# EasyEDA schematic SCH_LUMOS Reflective Device PCB_2023-02-24.json
TITLE: LUMOS Reflective device; REV: 1.0; Date: 2022-08-15; Sheet: 1/1
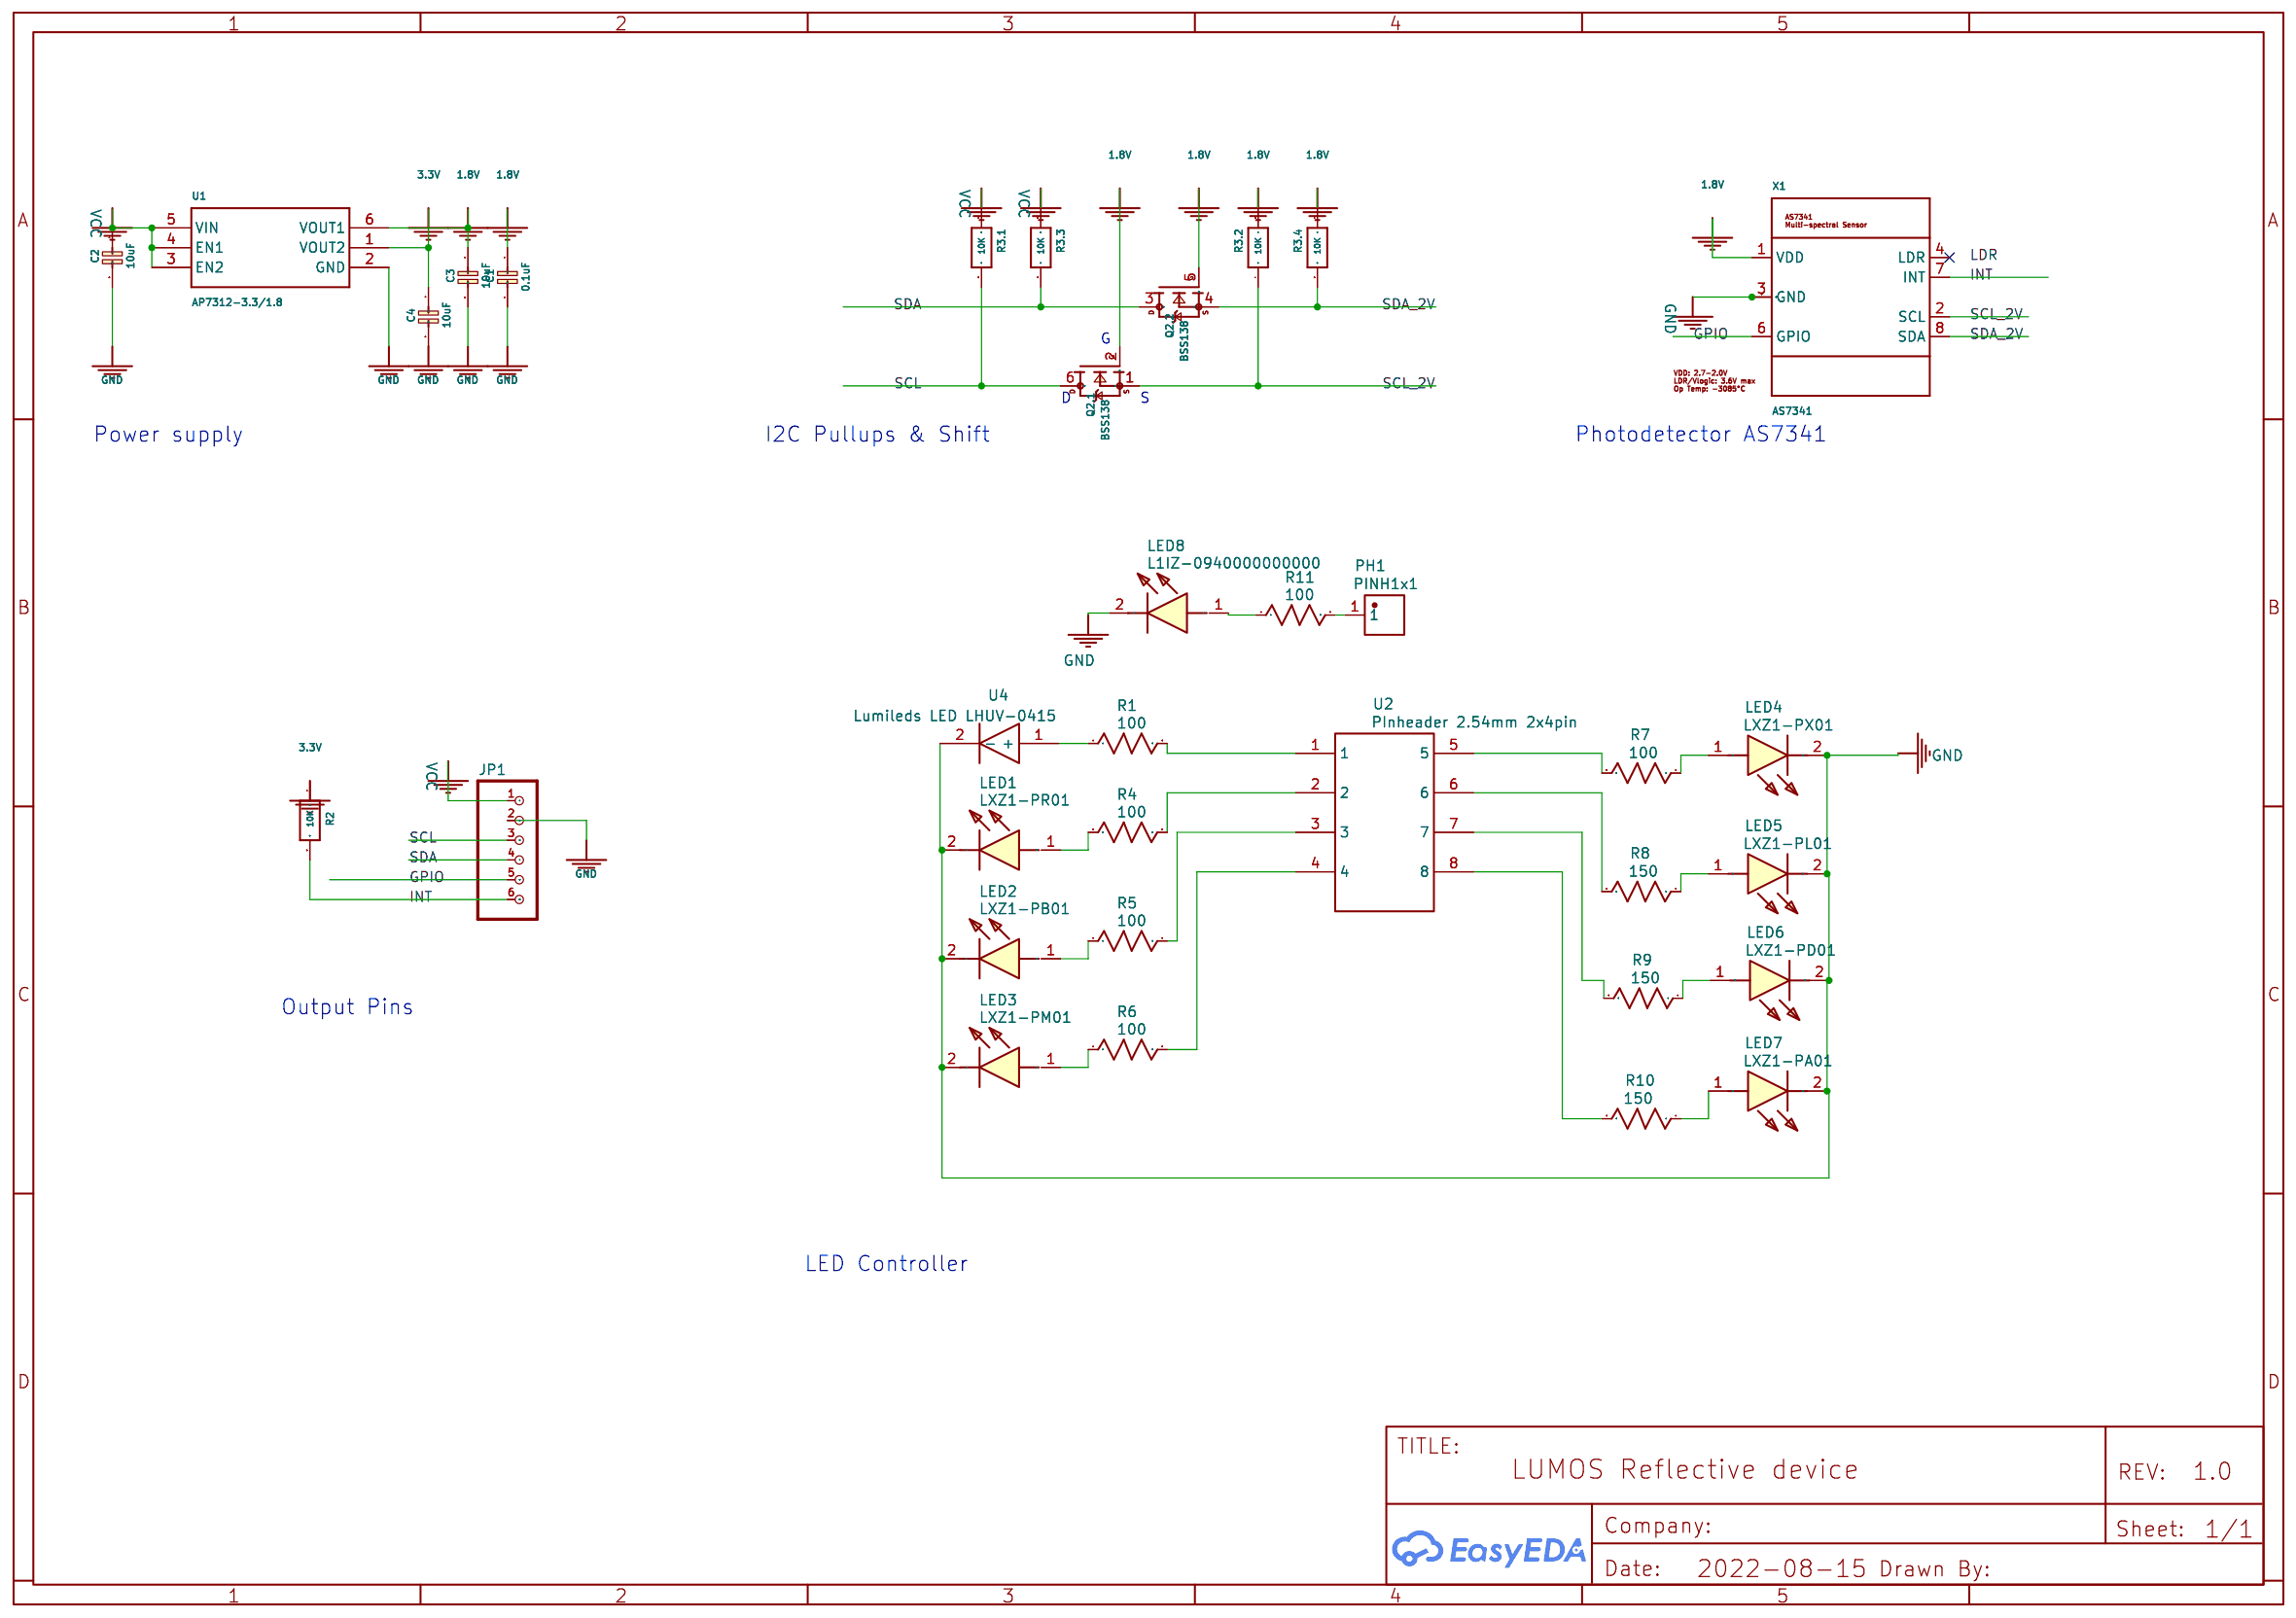
[diagram p0: schematic sheet]

## Parts
C1  0.1uF  [0603-NO]
C2  10uF  [0805-NO]
C3  10uF  [0805-NO]
C4  10uF  [0805-NO]
JP1  HEADER-1X670MIL  [1X06]
LED1  LXZ1-PR01  [LXZ1PR01]
LED2  LXZ1-PB01  [LXZ1PR01]
LED3  LXZ1-PM01  [LXZ1PR01]
LED4  LXZ1-PX01  [LXZ1PR01]
LED5  LXZ1-PL01  [LXZ1PR01]
LED6  LXZ1-PD01  [LXZ1PR01]
LED7  LXZ1-PA01  [LXZ1PR01]
LED8  L1IZ-0940000000000  [LXZ1PR01]
PH1  PINH1x1  [PINHEADER_1X1]
Q2  BSS138  [PG-SOT363-6_L2.0-W1.3-P0.65-LS2.1-BR]  (sections 1,2)
R1  100  [R0603]
R2  10K  [0603-NO]
R3  10K  [R_ARRAY_CONCAVE_4X0603]  (sections 1,2,3,4)
R4  100  [R0603]
R5  100  [R0603]
R6  100  [R0603]
R7  100  [R0603]
R8  150  [R0603]
R9  150  [R0603]
R10  150  [R0603]
R11  100  [R0603]
U1  AP7312-3.3/1.8  [PG-SOT23-6_L2.9-W1.6-P0.95-LS2.8-BR]
U2  PInheader 2.54mm 2x4pin  [PINHEADER 2X4PIN]
U4  Lumileds LED LHUV-0415  [LUMILEDS LED LHUV-0415]
U$1  MOUNTINGHOLE2.5  [MOUNTINGHOLE_2.5_PLATED]
U$17  MOUNTINGHOLE2.5  [MOUNTINGHOLE_2.5_PLATED]
U$19  MOUNTINGHOLE2.5  [MOUNTINGHOLE_2.5_PLATED]
U$21  MOUNTINGHOLE2.5  [MOUNTINGHOLE_2.5_PLATED]
X1  AS7341  [AS7341]

## Library data of the parts
LED1-LED8 = LXZ1-PR01: Contributor: onemanarmy
PH1 = PINH1x1: Contributor: LeynaertV
R1 R4-R11 = R_0603_US: Contributor: LCEDA_Lib
U2 = PInheader 2.54mm 2x4pin: Contributor: pat.nieder05
U4 = Lumileds LED LHUV-0415: Manufacturer: Lumileds; Supplier: Mouser; link: https://www.mouser.com/ProductDetail/Lumileds/LHUV-0415-A070?qs=Au78WOuo%252BOdNiuSbXqPegw%3D%3D; Contributor: Евгений Индюков

## Nets
1.8V: C1.1 C3.1 Q2.2(G) Q2.5(G) R3.2(1) R3.4(1) U1.6(VOUT1) X1.1(VDD)
3.3V: C4.1 R2.1 U1.1(VOUT2)
GND: C1.2 C2.2 C3.2 C4.2 JP1.2 LED1.2(K) LED2.2(K) LED3.2(K) LED4.2(K) LED5.2(K) LED6.2(K) LED7.2(K) LED8.2(K) U1.2(GND) U4.2(-) X1.3(GND) X1.5(GND)
VCC: C2.1 JP1.1 R3.1 R3.3(1) U1.3(EN2) U1.4(EN1) U1.5(VIN)
GPIO: JP1.5 X1.6(GPIO)
INT: JP1.6 R2.2 X1.7(INT)
SCL: JP1.3 Q2.6(D) R3.8(2)
SCL_2V: Q2.1(S) R3.7(2) X1.2(SCL)
SDA: JP1.4 Q2.3(D) R3.6(2)
SDA_2V: Q2.4(S) R3.5(2) X1.8(SDA)
Net-(LED1-1): LED1.1(A) R4.1
Net-(LED2-1): LED2.1(A) R5.1
Net-(LED3-1): LED3.1(A) R6.1
Net-(LED4-1): LED4.1(A) R7.1
Net-(LED5-1): LED5.1(A) R8.1
Net-(LED6-1): LED6.1(A) R9.1
Net-(LED7-1): LED7.1(A) R10.1
Net-(LED8-1): LED8.1(A) R11.1
Net-(PH1-1): PH1.1 R11.2
Net-(R1-1): R1.1 U4.1(+)
Net-(R1-2): R1.2 U2.1
Net-(R4-2): R4.2 U2.2
Net-(R5-2): R5.2 U2.3
Net-(R6-2): R6.2 U2.4
Net-(R7-2): R7.2 U2.5
Net-(R8-2): R8.2 U2.6
Net-(R9-2): R9.2 U2.7
Net-(R10-2): R10.2 U2.8

Not connected (* = marked no-connect by the designer): X1 4(LDR)*

## Notes on the sheet
- G
- D
- S
- Power supply
- I2C Pullups & Shift
- Photodetector AS7341
- Output Pins
- LED Controller
